# Altium schematic sheet MicroSD.SchDoc
size A; SheetNumber: 7; SheetTotal: 8
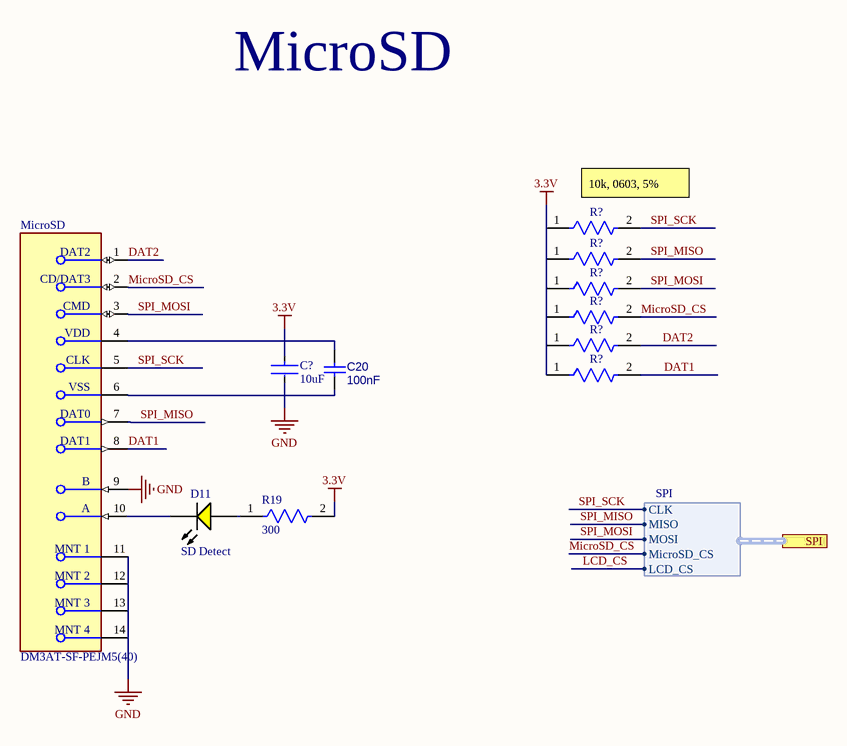
[diagram p0: MicroSD.SchDoc]

## Parts
(Parts that share a designator on the sheet are numbered #1, #2 ... from top to bottom, then left to right.)
C20  100nF  [CAPC2013X95X50LL10T25]
C?  10uF  [FP-GCM32E-0_3-IPC_B]
D11  SD Detect  [LTST-C170KSKT_V]
MicroSD  DM3AT-SF-PEJM5(40)  [FP-DM3AT-SF-PEJM5_40-MFG]
R19  300  [FP-CR0805-MFG]
R?#1  10k  [FP-AC0603-IPC_A]  (value not drawn)
R?#2  10k  [FP-AC0603-IPC_A]  (value not drawn)
R?#3  10k  [FP-AC0603-IPC_A]  (value not drawn)
R?#4  10k  [FP-AC0603-IPC_A]  (value not drawn)
R?#5  10k  [FP-AC0603-IPC_A]  (value not drawn)
R?#6  10k  [FP-AC0603-IPC_A]  (value not drawn)

## Ports
SPI (harness SPI)

## Harnesses
SPI: MISO, MOSI, CLK, MicroSD_CS, LCD_CS

## Nets
3.3V: C20.2 C?.2 MicroSD.4(VDD) R19.2 R?#1.1 R?#2.1 R?#3.1 R?#4.1 R?#5.1 R?#6.1
GND: C20.1 C?.1 MicroSD.6(VSS) MicroSD.9(B) MicroSD.11(MNT_1) MicroSD.12(MNT_2) MicroSD.13(MNT_3) MicroSD.14(MNT_4)
DAT1: MicroSD.8(DAT1) R?#6.2
DAT2: MicroSD.1(DAT2) R?#5.2
LCD_CS: port SPI.LCD_CS
MicroSD_CS: MicroSD.2(CD/DAT3) R?#4.2 ; port SPI.MicroSD_CS
SPI_MISO: MicroSD.7(DAT0) R?#2.2 ; port SPI.MISO
SPI_MOSI: MicroSD.3(CMD) R?#3.2 ; port SPI.MOSI
SPI_SCK: MicroSD.5(CLK) R?#1.2
NetD11_1: D11.1(A) R19.1
NetD11_2: D11.2(K) MicroSD.10(A)

## Notes on the sheet
- MicroSD
- (near R?#1) 10k, 0603, 5%

## Library data of the parts
C20 = CMP-001-00018-6: Capacitor 100 nF +/-10% 50 V 0805; Voltage Rating: 50V; Tolerance: 10%; Capacitor Type: Ceramic; Value: 100nF; Pins: 2; Max Operating Temperature: 125°C; Min Operating Temperature: -55°C; Mounting Technology: SM; Case/Package: 0805; RoHS Compliant: True
C? = CMP-2000-06321-2: Ceramic Capacitor for Automotive 10uF ±10% 25VDC X7R 1210 Embossed T/R; Voltage: 25V; Thickness: 0.106inch; Min Operating Temperature: -55°C; Max Operating Temperature: 125°C; Ratings: AEC-Q200; Packaging: Tape and Reel; Package Quantity: 1; Width: 2.5mm; Mount: Surface Mount; Height: 2.5mm; Case Code (Imperial): 1210; Length: 3.2mm; Capacitance: 10uF; Tolerance: 10%; Lead Free: Lead Free; Dielectric: X7R; REACH SVHC: No SVHC; Case/Package: 1210; Voltage Rating: 25V; Depth: 2.5mm; Case Code (Metric): 3225; Termination: SMD/SMT; Voltage Rating (DC): 25V; Radiation Hardening: No
D11 = CMP-2000-06621-1: LTST-C170KSKT LED Yellow, 75 mW, 80 mA, -55 to 85 degC, 2-Pin SMD, RoHS, Tape and Reel; Manufacturer: Lite-On; Main Category: ChipLED; Product Depth (mm): 1.25mm; Dominant Wave Length: 587nm; Viewing Angle: 130deg; Luminous Intensity: 112mcd; Test Current (It): 20mA; Emitting Color: Amber; Chip Material: AlGaInP; Product Height (mm): 1.1mm; Forward Voltage: 2.4V; High Brightness: Yes; Forward Current: 30mA; Number of  Elements: 1; Power Dissipation: 75W; Type: Uni-Color; Shape Type: Rectangular; Peak Wavelength: 588nm; Reverse Voltage: 5V; Rad Hardened: No; Product Length (mm): 2mm; DELETED: Compliant; Package Description: 2-Pin Surface Mount Device, Body 2 x 1.25 mm; Mounting: SurfaceMount; Lum Intensity: 112mcd; Pin Count: 2; Mounting Technology: SurfaceMount; Package Reference: C170KSKT; Datasheet Version: Rev. H, 04/2014; Package Type: ChipLed; Packaging: TapeandReel; Manufacturer URL: http://www.us.liteon.com/; Datasheet URL: http://optoelectronics.liteon.com/upload/download/DS-22-99-0188/S_110_LTST-C170KSKT.pdf; Operating Temp Range: -55Cto85C; Lens Dimensions: 1.4x1.25x0.6mm; Operating Temperature Classification: Industrial
MicroSD = CMP-11597-000006-1: CONN MICRO SD R/A PUSH-PUSH SMD; Contact Resistance: 100mR; Insulation Resistance: 1GR; Gender: Receptacle; Max Voltage Rating (AC): 125V; Pitch: 1.1mm; Mating Cycles: 10000; Max Current Rating: 500mA; Connector Type: Connector; Number of Contacts: 8; Housing Material: Polymer; Flammability Rating: UL94 V-0; REACH SVHC: No SVHC; Lead Free: Lead Free; Package Quantity: 400; Length: 13.85mm; Number of Rows: 2; Series: DM3; Min Operating Temperature: -25°C; Voltage Rating (AC): 125V; Contact Material: Copper Alloy; Depth: 15.95mm; Contact Plating: Gold; Packaging: Tape and Reel; Width: 13.85mm; Orientation: Right Angle; Color: Black; Voltage Rating: 125V; Radiation Hardening: No; Termination: Solder; Current Rating: 500mA; Mount: Surface Mount; Max Operating Temperature: 85°C
R19 = CMP-07231-003646-1: CR0805-FX-3000ELF Thick Film Chip Resistors 0805 300Ω 0.125W 1% 100ppm/°C; Max Power Dissipation: 125mW; Voltage Rating: 150V; Resistance: 300R; Contact Plating: Tin; Number of Terminations: 2; Termination: SMD/SMT; Case Code (Imperial): 0805; Mount: Surface Mount; Length: 2mm; Thickness: 508um; Package Quantity: 1; Case Code (Metric): 2012; Width: 1.25mm; Military Standard: Not; Max Operating Temperature: 155°C; Temperature Coefficient: 100ppm/°C; Min Operating Temperature: -55°C; Features: Moisture Resistant; Radiation Hardening: No; Composition: Thick Film; Height: 0.024inch; Power Rating: 125mW; Depth: 1.25mm; Tolerance: 1%; Packaging: Tape and Reel; Case/Package: 0805
R?#1-R?#6 = CMP-03412-040683-1: RES 10kΩ 5.00% 0.2W 0603